# Altium schematic sheet peripheral_uSD.SchDoc: uSD Card Module
size A3; Author: mayerph; DrawnBy: mayerph; Organization: IIS; Revision: PA; SheetNumber: 3; SheetTotal: 3
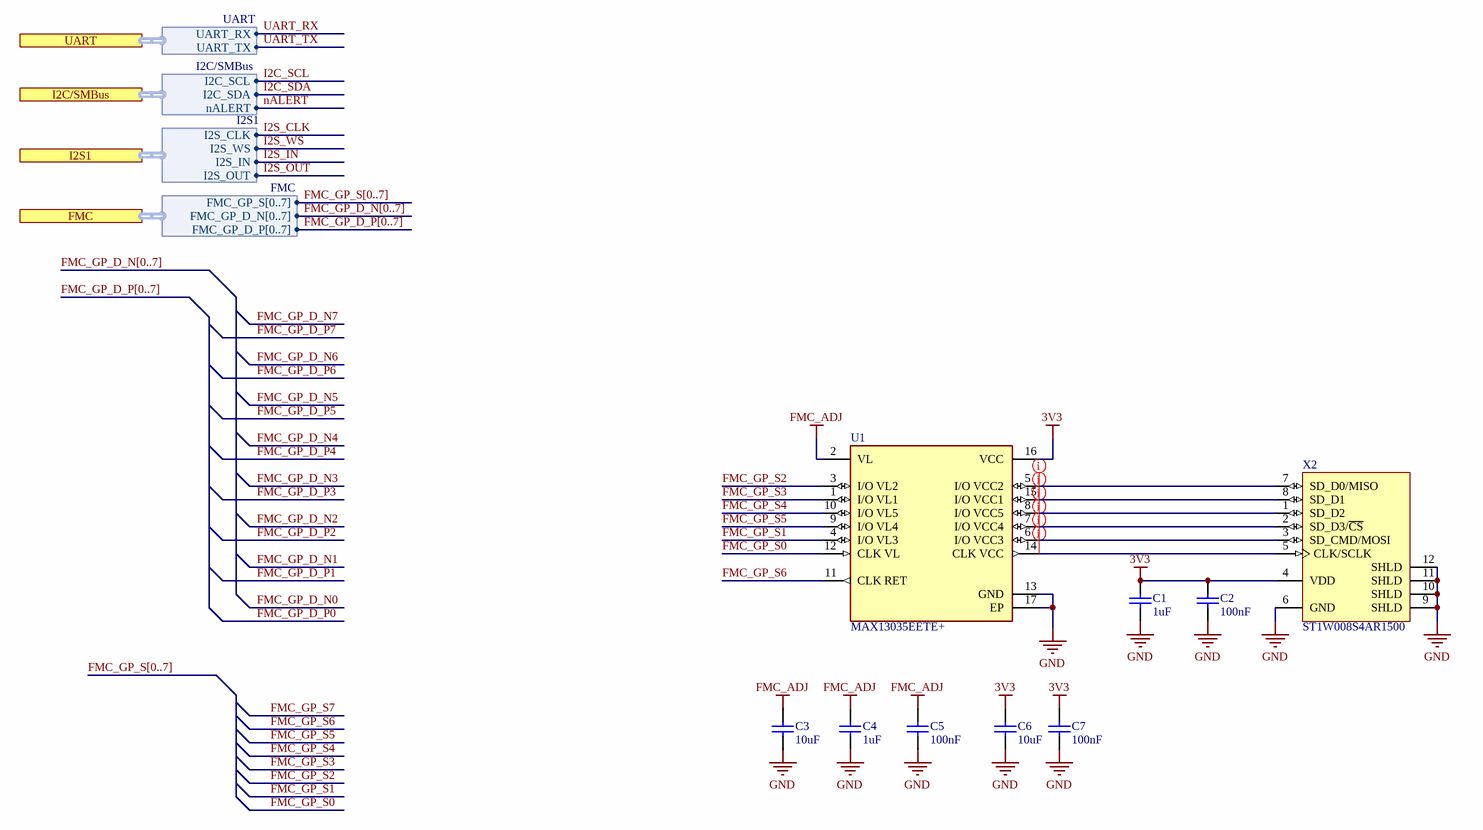
[diagram p0: peripheral_uSD.SchDoc]

## Parts
C1  1uF  [CAPC1005X60X30LL05T10]
C2  100nF  [CAPC1050X55X23LL05T13]
C3  10uF  [CAPC1608X90X35LL15T15]
C4  1uF  [CAPC1005X60X30LL05T10]
C5  100nF  [CAPC1050X55X23LL05T13]
C6  10uF  [CAPC1608X90X35LL15T15]
C7  100nF  [CAPC1050X55X23LL05T13]
U1  MAX13035EETE+  [FP-T1644-4-MFG]
X2  ST1W008S4AR1500  [ST1W008S4AR1500]

## Ports
FMC (harness FMC), I2C/SMBus (harness I2C/SMBus), I2S1 (harness I2S1), UART (harness UART)

## Harnesses
I2C/SMBus: I2C_SDA, I2C_SCL, nALERT
UART: UART_TX, UART_RX
I2S1: I2S_OUT, I2S_IN, I2S_WS, I2S_CLK
FMC: FMC_GP_D_N[0..7], FMC_GP_S[0..7], FMC_GP_D_P[0..7]

## Nets
3V3: C1.2 C2.2 C6.2 C7.2 U1.16(VCC) X2.4(VDD)
FMC_ADJ: C3.2 C4.2 C5.2 U1.2(VL)
GND: C1.1 C2.1 C3.1 C4.1 C5.1 C6.1 C7.1 U1.13(GND) U1.17(EP) X2.6(GND) X2.9(SHLD) X2.10(SHLD) X2.11(SHLD) X2.12(SHLD)
FMC_GP_S0: U1.12(CLK_VL)
FMC_GP_S1: U1.4(I/O_VL3)
FMC_GP_S2: U1.3(I/O_VL2)
FMC_GP_S3: U1.1(I/O_VL1)
FMC_GP_S4: U1.10(I/O_VL5)
FMC_GP_S5: U1.9(I/O_VL4)
FMC_GP_S6: U1.11(CLK_RET)
I2C_SCL: port I2C/SMBus.I2C_SCL
I2C_SDA: port I2C/SMBus.I2C_SDA
I2S_CLK: port I2S1.I2S_CLK
I2S_IN: port I2S1.I2S_IN
I2S_OUT: port I2S1.I2S_OUT
I2S_WS: port I2S1.I2S_WS
nALERT: port I2C/SMBus.nALERT
UART_RX: port UART.UART_RX
UART_TX: port UART.UART_TX
NetU1_5: U1.5(I/O_VCC2) X2.7(SD_D0/MISO)
NetU1_6: U1.6(I/O_VCC3) X2.3(SD_CMD/MOSI)
NetU1_7: U1.7(I/O_VCC4) X2.2(SD_D3/~{CS})
NetU1_8: U1.8(I/O_VCC5) X2.1(SD_D2)
NetU1_14: U1.14(CLK_VCC) X2.5(CLK/SCLK)
NetU1_15: U1.15(I/O_VCC1) X2.8(SD_D1)

## Buses and harness runs
bus FMC_GP_D_N[0..7]
bus FMC_GP_D_P[0..7]
bus FMC_GP_S[0..7]

## Layout directives
net class S_GP2; net class SE_50R: NetU1_5, NetU1_6, NetU1_7, NetU1_8, NetU1_14, NetU1_15

## Notes on the sheet
- 1
- 2
- 3
- 4
- 5
- 6
- 7
- 8
- A
- B
- C
- D
- Project:
- Date:
- Drawing number:
- Rev:
- Format:
- A3
- Drawn by:
- Laboratory:
- Page
- Sheet:
- of
- File:

## Library data of the parts
C1 C4 = CMP-2008-02044-1: Part Number: C0402C105K9PACTU; Manufacturer: Kemet; Dielectric Material: Ceramic; Tolerance: 10%; Voltage Rating: 6.3V; Dielectric: X5R; Supplier 1: Digi-Key; Supplier Part Number 1: 399-4873-6-ND; Manufacturer Part Number: C0402C105K9PACTU; RoHS: Yes; Category: Ceramic Capacitors; Stock 1: 1737568; Pricing 1: 1=0.10000, 10=0.02600, 100=0.01180, 500=0.00844, 1000=0.00662, 2500=0.00602, 5000=0.00554 (USD); Mount: Surface Mount; Case/Package: 0402; Number of Pins: 2; Case Code (Imperial): 0402; Min Operating Temperature: -55°C; Max Operating Temperature: 85°C; Value: 1uF; Packaging: Tape and Reel; Voltage Rating (DC): 6.3V; Package Quantity: 1; Termination: SMD/SMT; Voltage: 6.3V; Length: 1mm; Height: 0.5mm; Width: 0.02inch; Thickness: 0.022inch; Depth: 0.5mm; Lead Pitch: 0.3mm; Radiation Hardening: No; Lead Free: Lead Free; REACH SVHC: No SVHC; ComponentLink1URL: https://datasheet.ciiva.com/28645/1789732-28645392.pdf?src-supplier=Element14; ComponentLink1Description: https://datasheet.ciiva.com/28645/1789732-28645392.pdf?src-supplier=Element14; ComponentLink2URL: https://datasheet.ciiva.com/11786/0900766b8116eb59-11786028.pdf?src-supplier=RSComponents; ComponentLink2Description: https://datasheet.ciiva.com/11786/0900766b8116eb59-11786028.pdf?src-supplier=RSComponents; ComponentLink3URL: https://datasheet.ciiva.com/7747/kem-c1006-x5r-smd-7747445.pdf?src-supplier=Element14; ComponentLink3Description: https://datasheet.ciiva.com/7747/kem-c1006-x5r-smd-7747445.pdf?src-supplier=Element14; ComponentLink4URL: https://datasheet.ciiva.com/7747/40889-7747623.pdf?src-supplier=Element14; ComponentLink4Description: https://datasheet.ciiva.com/7747/40889-7747623.pdf?src-supplier=Element14; ComponentLink5URL: https://datasheet.ciiva.com/18192/getdatasheetpartid-127800-18192427.pdf?src-supplier=Verical; ComponentLink5Description: https://datasheet.ciiva.com/18192/getdatasheetpartid-127800-18192427.pdf?src-supplier=Verical
C2 C5 C7 = CMP-2000-05439-1: Chip Capacitor, 100 nF, +/- 10%, 16 V, -55 to 125 degC, 0402 (1005 Metric), RoHS, Tape and Reel; Manufacturer: Samsung Electro-Mechanics; Manufacturer Part Number: CL05B104KO5NNNC; Dielectric: X7R; Rated Voltage: 16V; Material: Ceramic; Case Size/Dimension: 0402; Tolerance (%): ±10%; Value: 100nF; Manufacturer URL: http://www.samsungsem.com/global/index.jsp; Datasheet URL: https://datasheet.ciiva.com/29198/458718-da-01-en-vs-kondensator-0402-29198423.pdf; Datasheet Version: Nov-10; Supplier 1: Digi-Key; Supplier Part Number 1: 1276-1001-1-ND; RoHS: Yes; Category: Ceramic Capacitors; Stock 1: 18886859; Pricing 1: 1=0.10000, 10=0.02800, 50=0.01520, 100=0.01240, 500=0.00886, 1000=0.00696, 2500=0.00632, 5000=0.00582 (USD); Mount: Surface Mount; Case/Package: 0402; Case Code (Metric): 1005; Case Code (Imperial): 0402; Contact Plating: Tin; Min Operating Temperature: -55°C; Max Operating Temperature: 125°C; Tolerance: 10%; Packaging: Tape and Reel; Voltage Rating: 16V; Voltage Rating (DC): 16V; Package Quantity: 1; Voltage: 16V; Length: 1mm; Height: 0.5mm; Width: 0.02inch; Depth: 0.5mm; Thickness: 0.022inch; Radiation Hardening: No; Lead Free: Lead Free; ComponentLink1URL: https://datasheet.ciiva.com/26920/getdatasheetpartid-359683-26920169.pdf?src-supplier=Verical; ComponentLink1Description: https://datasheet.ciiva.com/26920/getdatasheetpartid-359683-26920169.pdf?src-supplier=Verical; ComponentLink2URL: https://datasheet.ciiva.com/29198/458718-da-01-en-vs-kondensator-0402-29198423.pdf?src-supplier=Conrad; ComponentLink2Description: https://datasheet.ciiva.com/29198/458718-da-01-en-vs-kondensator-0402-29198423.pdf?src-supplier=Conrad; ComponentLink3URL: https://datasheet.ciiva.com/16208/cl05b104kq5nnnc-16208343.pdf?src-supplier=Future+Electronics; ComponentLink3Description: https://datasheet.ciiva.com/16208/cl05b104kq5nnnc-16208343.pdf?src-supplier=Future+Electronics; ComponentLink4URL: https://datasheet.ciiva.com/26309/mlcc-catalogdownload2013-eng-26309003.pdf?src-supplier=Distrelec; ComponentLink4Description: https://datasheet.ciiva.com/26309/mlcc-catalogdownload2013-eng-26309003.pdf?src-supplier=Distrelec
C3 C6 = CMP-2006-04476-1: Manufacturer: AVX Interconnect / Elco; Part Number: 06036D106MAT2A; Dielectric Material: Ceramic; Tolerance: 20%; Voltage Rating: 6.3V; Dielectric: X5R; Supplier 1: Digi-Key; Supplier Part Number 1: 478-5318-1-ND; Manufacturer Part Number: 06036D106MAT2A; RoHS: Yes; Category: Ceramic Capacitors; Stock 1: 1934840; Pricing 1: 1=0.24000, 10=0.16500, 50=0.09900, 100=0.08360, 500=0.05720, 1000=0.05060 (USD); Mount: Surface Mount,PCB; Case/Package: 0603; Number of Pins: 2; Case Code (Metric): 1608; Case Code (Imperial): 0603; Contact Plating: Tin,Matte; Min Operating Temperature: -55°C; Max Operating Temperature: 85°C; Value: 10uF; Packaging: Tape and Reel; Package Quantity: 1; Voltage Rating (DC): 6.3V; Termination: SMD/SMT; Series: -; Construction: Flat; Voltage: 6.3V; Length: 1.6mm; Width: 0.032inch; Height: 0.9mm; Thickness: 0.035inch; Depth: 0.81mm; Radiation Hardening: No; RoHS Compliant: Yes; Lead Free: Lead Free; REACH SVHC: No SVHC; ComponentLink1URL: https://datasheet.ciiva.com/153/cx5r-153301.pdf?src-supplier=Digi-Key; ComponentLink1Description: https://datasheet.ciiva.com/153/cx5r-153301.pdf?src-supplier=Digi-Key; ComponentLink2URL: https://datasheet.ciiva.com/1458/1796776-1458117.pdf?src-supplier=Element14; ComponentLink2Description: https://datasheet.ciiva.com/1458/1796776-1458117.pdf?src-supplier=Element14; ComponentLink3URL: https://datasheet.ciiva.com/153/cx5r-153302.pdf?src-supplier=Digi-Key; ComponentLink3Description: https://datasheet.ciiva.com/153/cx5r-153302.pdf?src-supplier=Digi-Key; ComponentLink4URL: https://datasheet.ciiva.com/153/cx5r-153303.pdf?src-supplier=Digi-Key; ComponentLink4Description: https://datasheet.ciiva.com/153/cx5r-153303.pdf?src-supplier=Digi-Key; ComponentLink5URL: https://datasheet.ciiva.com/5422/cx5r-33896-5422935.pdf?src-supplier=Mouser; ComponentLink5Description: https://datasheet.ciiva.com/5422/cx5r-33896-5422935.pdf?src-supplier=Mouser; ComponentLink6URL: https://datasheet.ciiva.com/16538/cx5r-16538025.pdf?src-supplier=Avnet+Asia; ComponentLink6Description: https://datasheet.ciiva.com/16538/cx5r-16538025.pdf?src-supplier=Avnet+Asia; ComponentLink7URL: https://datasheet.ciiva.com/2987/cx5r-2987866.pdf?src-supplier=Avnet; ComponentLink7Description: https://datasheet.ciiva.com/2987/cx5r-2987866.pdf?src-supplier=Avnet; ComponentLink8URL: https://datasheet.ciiva.com/14591/70001028-14591754.pdf?src-supplier=Allied+Electronics; ComponentLink8Description: https://datasheet.ciiva.com/14591/70001028-14591754.pdf?src-supplier=Allied+Electronics; ComponentLink9URL: https://datasheet.ciiva.com/2987/cx5r-2987867.pdf?src-supplier=Avnet; ComponentLink9Description: https://datasheet.ciiva.com/2987/cx5r-2987867.pdf?src-supplier=Avnet; ComponentLink10URL: https://datasheet.ciiva.com/16201/cx5r-16201627.pdf?src-supplier=Future+Electronics; ComponentLink10Description: https://datasheet.ciiva.com/16201/cx5r-16201627.pdf?src-supplier=Future+Electronics
U1 = CMP-05703-000003-1: IC TRNSLTR BIDIRECTIONAL 16TQFN; Manufacturer: Maxim; Number Of Circuits: 1; Number Of Inputs: 6; V A Min: 2.2V; Data Rate: 100Mbits/s; Min Supply Voltage: 1.62V; Propagation Delay: 6.5ns; Standoff Height: 0mm; Max Supply Voltage: 3.6V; Logic Function Desc: Non-Inverting; Max Junction Temp: +150°C; V B Max: 3.2V; Nominal Supply Current: 6-16uA; Logic Function: Translator; High Level Output Current: -20uA; Low Level Output Current: 20uA; Max Power Dissipation: 2W; Supply Current: 2uA; Device Class L3: Voltage Level Shifters; Package: T1644-4; Digikey Description: IC TRNSLTR BIDIRECTIONAL 16TQFN; Category: IC; Temperature Range High: +85°C; Lead Free: Yes; Octopart: https://octopart.com/max13035eete%2B-maxim+integrated-39866737; Height: 0.8mm; Device Class L2: Logic ICs; ComponentLink2Description: Datasheet; Device Class L1: Integrated Circuits (ICs); Ipc Land Pattern Name: QFN65P400X400X75-16; Manufacturer Part Number: MAX13035EETE+; Temperature: -40°C to +85°C; Footprint Url: https://pdfserv.maximintegrated.com/land_patterns/90-0070.PDF; V A Max: 3.6V; Mouser Description: Translation - Voltage Levels 6Ch High-Speed; Temperature Range Low: -40°C; Number Of Outputs: 6; RoHS: TRUE; V B Min: 1.62V; ComponentLink2URL: https://datasheets.maximintegrated.com/en/ds/MAX13030E-MAX13035E.pdf; Automotive: No; Supplier 1: Digi-Key; Supplier Part Number 1: MAX13035EETE+-ND; Stock 1: 1404; Pricing 1: 1=9.01000, 10=8.13600, 25=7.75760, 100=6.73590, 250=6.43312, 500=5.86552, 1000=5.10867, 2500=4.91946, 5000=4.81950 (USD); Mount: Surface Mount; Number of Pins: 16; Min Operating Temperature: -40°C; Max Operating Temperature: 85°C; Package Quantity: 75; Number of Channels: 6; Packaging: Rail/Tube; Number of Bits: 6; Series: -; Turn-On Delay Time: 6.5ns; Length: 4mm; Width: 4mm; Radiation Hardening: No; RoHS Compliant: Yes; REACH SVHC: Unknown; ComponentLink1URL: https://datasheet.ciiva.com/1901/max13030e-max13035e-1901479.pdf?src-supplier=Digi-Key; ComponentLink1Description: https://datasheet.ciiva.com/1901/max13030e-max13035e-1901479.pdf?src-supplier=Digi-Key; ComponentLink3URL: https://datasheet.ciiva.com/17370/max13030e-max13035e-17370199.pdf?src-supplier=Avnet+Europe; ComponentLink3Description: https://datasheet.ciiva.com/17370/max13030e-max13035e-17370199.pdf?src-supplier=Avnet+Europe; ComponentLink4URL: https://datasheet.ciiva.com/14287/max13030e-max13035e-14287387.pdf?src-supplier=Avnet; ComponentLink4Description: https://datasheet.ciiva.com/14287/max13030e-max13035e-14287387.pdf?src-supplier=Avnet
X2 = CMP-00689-1: Memory Card Connectors MICRO SD HINGE TYPE OPEN on cover; Manufacturer: JAE Electronics; Number of Contacts: 8; Mating Cycles: 10000; Current Rating: 500mA; Voltage Rating: 10V; Gender: Female; Pitch: 1.1mm; Mount: Surface Mount; Contact Material: Copper Alloy; Contact Plating: Gold; Housing Material: Resin; Packaging: Tape and Reel; Package Quantity: 1500; Number of Positions: 8; Connector Type: Connector; Termination: SMD/SMT; Orientation: Right Angle; Number of Rows: 1; Height: 2mm; Lead Free: Lead Free; Manufacturer Part Number: ST1W008S4AR1500; Supplier: Digi-Key; Supplier Part Number: 670-2921-1-ND; ComponentLink1Description: cardconn-microsd-pg-v2-2-6934295.pdf; ComponentLink1URL: https://datasheet.ciiva.com/6934/cardconn-microsd-pg-v2-2-6934295.pdf